# EAGLE design Sens_CC2D (EAGLE 6.5.0)
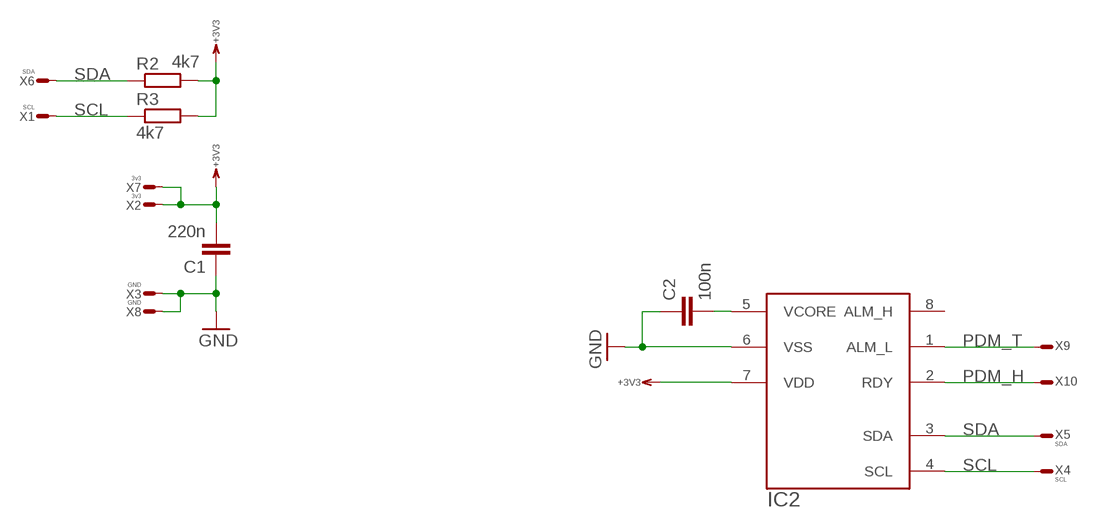
[diagram p0: schematic, sheet 1]

## Parts
C1  220n  C0603  [0603]
C2  100n  C0603  [0603]
IC2  CC2D  [CC2D]
R2  4k7  R0603  [0603]
R3  4k7  R0603  [0603]
X1  SCL  WIREPADT1.6/0.9  [T1.6/0.9]
X2  3v3  WIREPADT1.6/0.9  [T1.6/0.9]
X3  GND  WIREPADT1.6/0.9  [T1.6/0.9]
X4  SCL  WIREPADT1.6/0.9  [T1.6/0.9]
X5  SDA  WIREPADT1.6/0.9  [T1.6/0.9]
X6  SDA  WIREPADT1.6/0.9  [T1.6/0.9]
X7  3v3  WIREPADT1.6/0.9  [T1.6/0.9]
X8  GND  WIREPADT1.6/0.9  [T1.6/0.9]
X9  WIREPADR  [S1.27R]
X10  WIREPADR  [S1.27R]

## Nets
+3V3: C1.2 IC2.7(VDD) R2.2 R3.2 X2.1(S) X7.1(S)
GND: C1.1 C2.1 IC2.6(VSS) X3.1(S) X8.1(S)
N$1: C2.2 IC2.5(VCORE)
PDM_H: IC2.2(RDY) X10.1(S)
PDM_T: IC2.1(ALM_L) X9.1(S)
SCL: IC2.4(SCL) R3.1 X1.1(S) X4.1(S)
SDA: IC2.3(SDA) R2.1 X5.1(S) X6.1(S)
Unconnected: IC2.8(ALM_H)

## Library data of the parts
C1 C2 = RCL:C: Capacitor SMD
IC2 = Sensors:CC2D
R2 R3 = RCL:R: Resistor SMD
X1-X10 = Conn:WIREPAD: Wire PAD connect wire on PCB

## Board
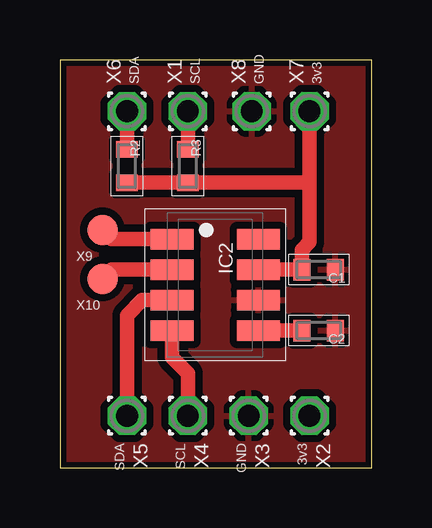
[diagram p1: board, top side]
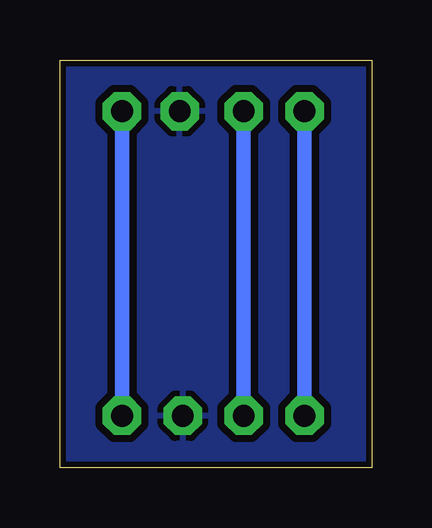
[diagram p2: board, bottom side, seen from below]

Size 13 x 17 mm. Coordinates in mm from the lower left corner, seen from the top.
Outline: 0,0 13,0 13,17 0,17 0,0
Copper layers (1*16): Top 0.035mm / dielectric 1.5mm / Bottom 0.035mm
Design rules "default *": minimum track width 10mil, minimum drill 12mil, track to track 12mil, track to pad 12mil, pad to pad 12mil, via to via 12mil, smd to smd 12mil, copper to edge 10mil, drill to drill 8mil, minimum pad ring 10mil, minimum via ring 8mil, stop-mask expansion 4mil, vias tented up to drill 0mil, thermal gap 10mil

### Footprints (pad centres in the part's own frame; a part is rotated, then mirrored left to right if it is on the bottom)
0603 = smd 0.7 x 0.9: 1 -0.697,0; 2 0.697,0
CC2D = smd 1.8 x 0.85: 1 1.8,-1.905; 2 1.8,-0.635; 3 1.8,0.635; 4 1.8,1.905; 5 -1.8,1.905; 6 -1.8,0.635; 7 -1.8,-0.635; 8 -1.8,-1.905
T1.6/0.9 = drill 0.914 pad 1.6 octagon: 1 0,0
S1.27R = smd 1.27 x 1.27: 1 0,0

### Placement (x,y rotation side)
C1  10.79,8.26 180 top
C2  10.79,5.71 180 top
IC2  6.48,7.62 180 top
R2  2.79,12.57 270 top
R3  5.33,12.57 270 top
X1  5.33,14.86 90 top
X2  10.41,2.16 270 top
X3  7.87,2.16 270 top
X4  5.33,2.16 270 top
X5  2.79,2.16 270 top
X6  2.79,14.86 90 top
X7  10.41,14.86 90 top
X8  8,14.86 90 top
X9  1.78,9.91 0 top
X10  1.78,7.87 0 top

### Tracks (layer width: path | path; a pad name or v marks a point on that pad's centre or on a via)
+3V3
  Top 0.61: 10.41,11.94 10.41,9.4 10.1,9.08 C1.2 IC2.7 | 10.41,11.94 X7.1 | 10.41,11.94 10.35,11.88 R3.2 R2.2
  Bottom 0.61: X7.1 X2.1
GND
  pour Top: 0,17 13,17 13,0 0,0
  pour Bottom: 0,0 13,0 13,17 0,17
N$1
  Top 0.61: IC2.5 C2.2
PDM_H
  Top 0.61: IC2.2 2.16,8.26 X10.1
PDM_T
  Top 0.61: IC2.1 2.16,9.53 X9.1
SCL
  Top 0.61: IC2.4 4.68,4.59 5.33,3.94 X4.1 | R3.1 X1.1
  Bottom 0.61: X4.1 X1.1
SDA
  Top 0.61: IC2.3 3.43,6.99 2.79,6.35 X5.1 | R2.1 X6.1
  Bottom 0.61: X5.1 X6.1